# Altium project PCB_Project.PrjPcb
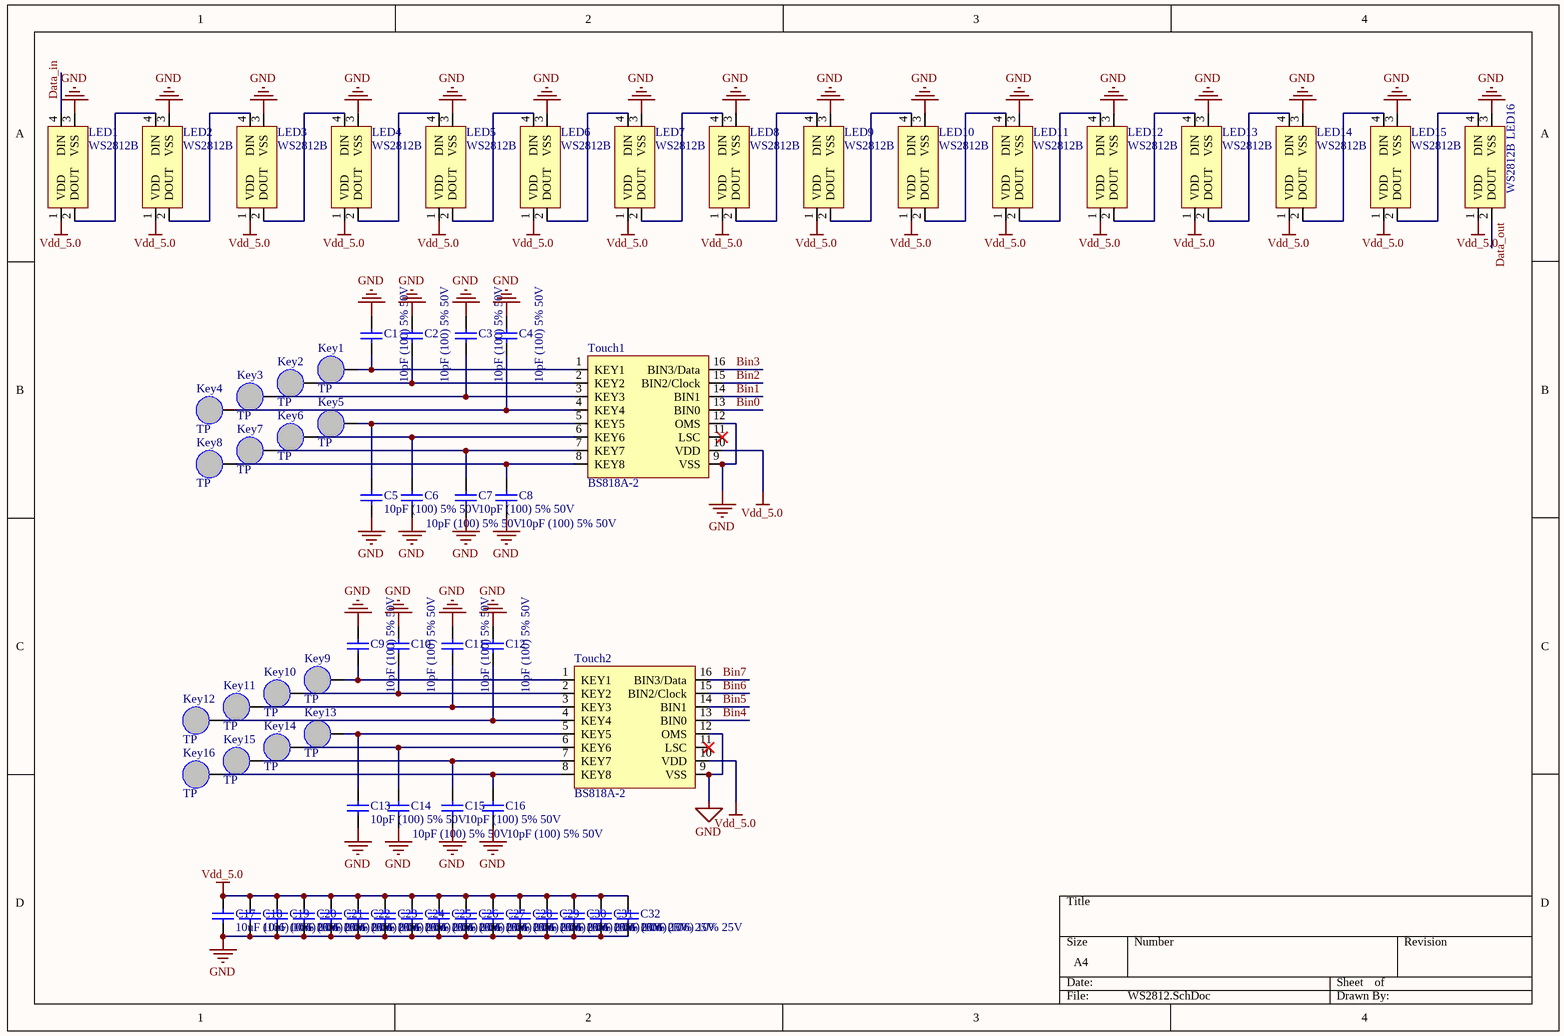
[diagram p0: WS2812.SchDoc]
3 sheets, 105 parts. Net scope: global (net labels, ports and power ports of the same name join across sheets).
Board file: Touch.PcbDoc
Sheets:
  WS2812.SchDoc
  MCU.SchDoc
  POWER.SchDoc

## Sheet WS2812.SchDoc
size A4

### Parts
C1  10pF (100) 5% 50V  [0603_C]
C2  10pF (100) 5% 50V  [0603_C]
C3  10pF (100) 5% 50V  [0603_C]
C4  10pF (100) 5% 50V  [0603_C]
C5  10pF (100) 5% 50V  [0603_C]
C6  10pF (100) 5% 50V  [0603_C]
C7  10pF (100) 5% 50V  [0603_C]
C8  10pF (100) 5% 50V  [0603_C]
C9  10pF (100) 5% 50V  [0603_C]
C10  10pF (100) 5% 50V  [0603_C]
C11  10pF (100) 5% 50V  [0603_C]
C12  10pF (100) 5% 50V  [0603_C]
C13  10pF (100) 5% 50V  [0603_C]
C14  10pF (100) 5% 50V  [0603_C]
C15  10pF (100) 5% 50V  [0603_C]
C16  10pF (100) 5% 50V  [0603_C]
C17  10uF (106) 10% 25V  [0805_C]
C18  10uF (106) 10% 25V  [0805_C]
C19  10uF (106) 10% 25V  [0805_C]
C20  10uF (106) 10% 25V  [0805_C]
C21  10uF (106) 10% 25V  [0805_C]
C22  10uF (106) 10% 25V  [0805_C]
C23  10uF (106) 10% 25V  [0805_C]
C24  10uF (106) 10% 25V  [0805_C]
C25  10uF (106) 10% 25V  [0805_C]
C26  10uF (106) 10% 25V  [0805_C]
C27  10uF (106) 10% 25V  [0805_C]
C28  10uF (106) 10% 25V  [0805_C]
C29  10uF (106) 10% 25V  [0805_C]
C30  10uF (106) 10% 25V  [0805_C]
C31  10uF (106) 10% 25V  [0805_C]
C32  10uF (106) 10% 25V  [0805_C]
Key1  TP  [Spring_touch]
Key2  TP  [Spring_touch]
Key3  TP  [Spring_touch]
Key4  TP  [Spring_touch]
Key5  TP  [Spring_touch]
Key6  TP  [Spring_touch]
Key7  TP  [Spring_touch]
Key8  TP  [Spring_touch]
Key9  TP  [Spring_touch]
Key10  TP  [Spring_touch]
Key11  TP  [Spring_touch]
Key12  TP  [Spring_touch]
Key13  TP  [Spring_touch]
Key14  TP  [Spring_touch]
Key15  TP  [Spring_touch]
Key16  TP  [Spring_touch]
LED1  WS2812B  [WS2812]
LED2  WS2812B  [WS2812]
LED3  WS2812B  [WS2812]
LED4  WS2812B  [WS2812]
LED5  WS2812B  [WS2812]
LED6  WS2812B  [WS2812]
LED7  WS2812B  [WS2812]
LED8  WS2812B  [WS2812]
LED9  WS2812B  [WS2812]
LED10  WS2812B  [WS2812]
LED11  WS2812B  [WS2812]
LED12  WS2812B  [WS2812]
LED13  WS2812B  [WS2812]
LED14  WS2812B  [WS2812]
LED15  WS2812B  [WS2812]
LED16  WS2812B  [WS2812]
Touch1  BS818A-2  [SO-16_N]
Touch2  BS818A-2  [SO-16_N]

### Nets
GND: C1.2 C2.2 C3.2 C4.2 C5.2 C6.2 C7.2 C8.2 C9.2 C10.2 C11.2 C12.2 C13.2 C14.2 C15.2 C16.2 C17.1 C18.1 C19.1 C20.1 C21.1 C22.1 C23.1 C24.1 C25.1 C26.1 C27.1 C28.1 C29.1 C30.1 C31.1 C32.1 LED1.3(VSS) LED2.3(VSS) LED3.3(VSS) LED4.3(VSS) LED5.3(VSS) LED6.3(VSS) LED7.3(VSS) LED8.3(VSS) LED9.3(VSS) LED10.3(VSS) LED11.3(VSS) LED12.3(VSS) LED13.3(VSS) LED14.3(VSS) LED15.3(VSS) LED16.3(VSS) Touch1.9(VSS) Touch1.12(OMS) Touch2.9(VSS) Touch2.12(OMS)  [project net POWER_GND]
Vdd_5.0: C17.2 C18.2 C19.2 C20.2 C21.2 C22.2 C23.2 C24.2 C25.2 C26.2 C27.2 C28.2 C29.2 C30.2 C31.2 C32.2 LED1.1(VDD) LED2.1(VDD) LED3.1(VDD) LED4.1(VDD) LED5.1(VDD) LED6.1(VDD) LED7.1(VDD) LED8.1(VDD) LED9.1(VDD) LED10.1(VDD) LED11.1(VDD) LED12.1(VDD) LED13.1(VDD) LED14.1(VDD) LED15.1(VDD) LED16.1(VDD) Touch1.10(VDD) Touch2.10(VDD)
Bin0: Touch1.13(BIN0)
Bin1: Touch1.14(BIN1)
Bin2: Touch1.15(BIN2/Clock)
Bin3: Touch1.16(BIN3/Data)
Bin4: Touch2.13(BIN0)
Bin5: Touch2.14(BIN1)
Bin6: Touch2.15(BIN2/Clock)
Bin7: Touch2.16(BIN3/Data)
Data_in: LED1.4(DIN)
Data_out: LED16.2(DOUT)
NetC1_1: C1.1 Key1.1 Touch1.1(KEY1)
NetC2_1: C2.1 Key2.1 Touch1.2(KEY2)
NetC3_1: C3.1 Key3.1 Touch1.3(KEY3)
NetC4_1: C4.1 Key4.1 Touch1.4(KEY4)
NetC5_1: C5.1 Key5.1 Touch1.5(KEY5)
NetC6_1: C6.1 Key6.1 Touch1.6(KEY6)
NetC7_1: C7.1 Key7.1 Touch1.7(KEY7)
NetC8_1: C8.1 Key8.1 Touch1.8(KEY8)
NetC9_1: C9.1 Key9.1 Touch2.1(KEY1)
NetC10_1: C10.1 Key10.1 Touch2.2(KEY2)
NetC11_1: C11.1 Key11.1 Touch2.3(KEY3)
NetC12_1: C12.1 Key12.1 Touch2.4(KEY4)
NetC13_1: C13.1 Key13.1 Touch2.5(KEY5)
NetC14_1: C14.1 Key14.1 Touch2.6(KEY6)
NetC15_1: C15.1 Key15.1 Touch2.7(KEY7)
NetC16_1: C16.1 Key16.1 Touch2.8(KEY8)
NetLED1_2: LED1.2(DOUT) LED2.4(DIN)
NetLED2_2: LED2.2(DOUT) LED3.4(DIN)
NetLED3_2: LED3.2(DOUT) LED4.4(DIN)
NetLED4_2: LED4.2(DOUT) LED5.4(DIN)
NetLED5_2: LED5.2(DOUT) LED6.4(DIN)
NetLED6_2: LED6.2(DOUT) LED7.4(DIN)
NetLED7_2: LED7.2(DOUT) LED8.4(DIN)
NetLED8_2: LED8.2(DOUT) LED9.4(DIN)
NetLED9_2: LED9.2(DOUT) LED10.4(DIN)
NetLED10_2: LED10.2(DOUT) LED11.4(DIN)
NetLED11_2: LED11.2(DOUT) LED12.4(DIN)
NetLED12_2: LED12.2(DOUT) LED13.4(DIN)
NetLED13_2: LED13.2(DOUT) LED14.4(DIN)
NetLED14_2: LED14.2(DOUT) LED15.4(DIN)
NetLED15_2: LED15.2(DOUT) LED16.4(DIN)

Not connected (* = marked no-connect by the designer): Touch1 11(LSC)*; Touch2 11(LSC)*

### Library data of the parts
C1-C16 = 0603 10pF (100) 5% 50V: 贴片电容; ComponentLink1Description: 供应商链接; ComponentLink1URL: http://www.szlcsc.com/product/details_1986.html; Package: 0603; Supplier: LC; SuppliersPartNumber: C1634
C17-C32 = 0805 10uF (106) 10% 25V: 贴片电容; ComponentLink1Description: 供应商链接; ComponentLink1URL: http://www.szlcsc.com/product/details_16532.html; Package: 0805; Supplier: LC; SuppliersPartNumber: C15850

## Sheet MCU.SchDoc
size A4
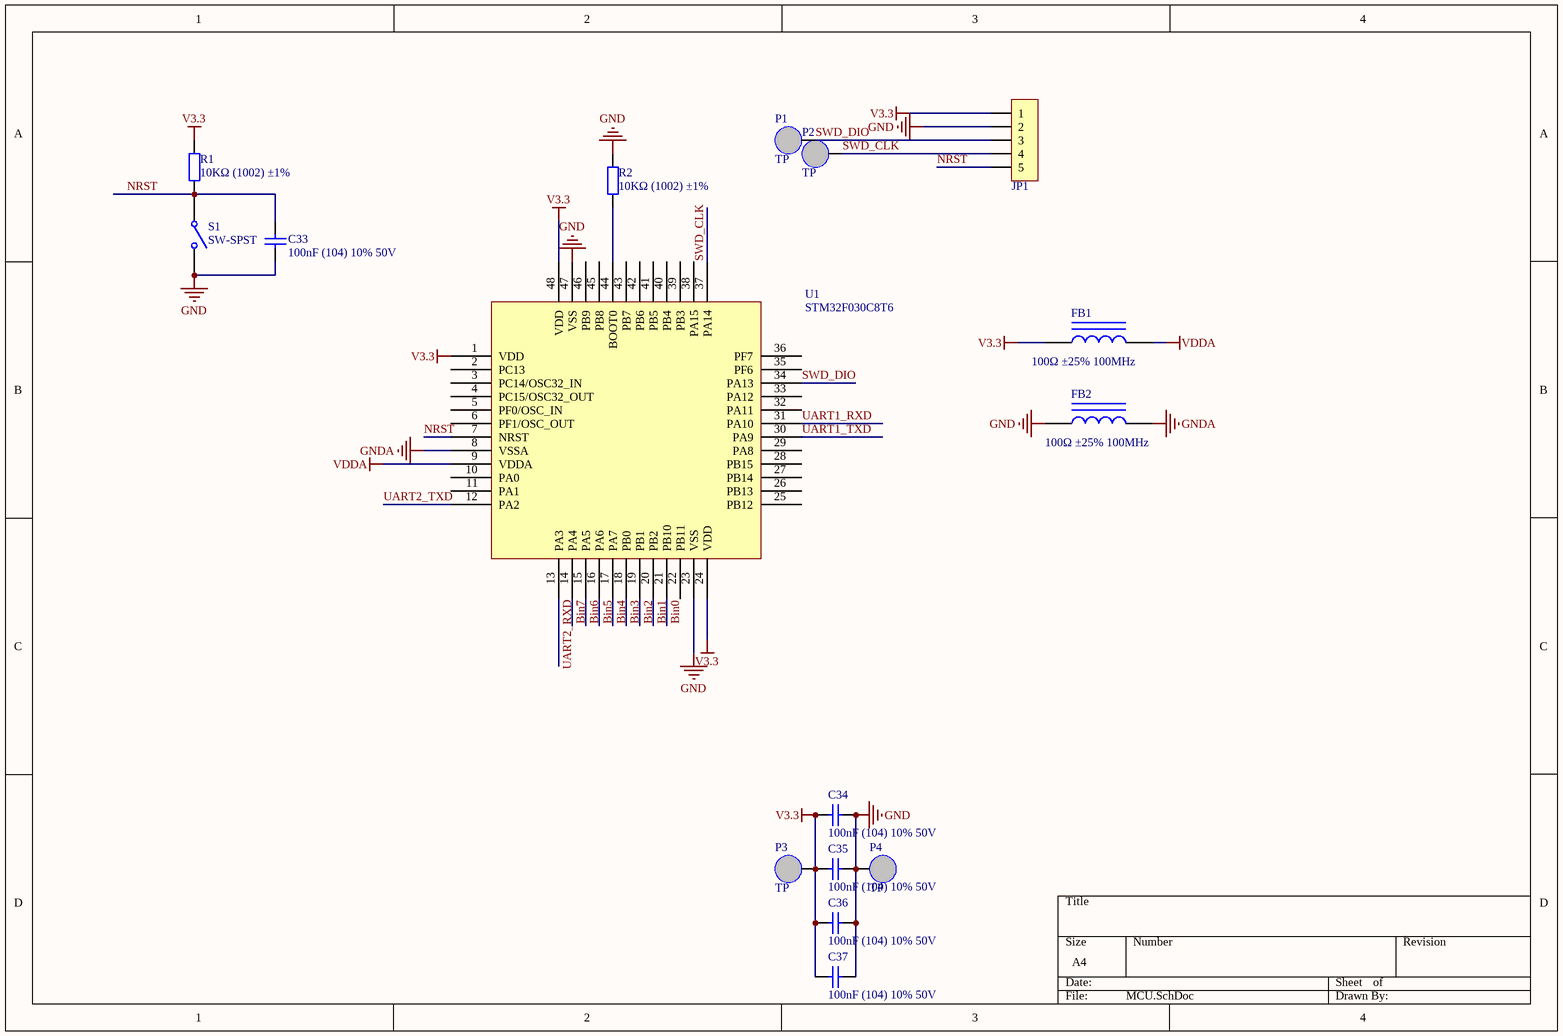
[diagram p1: MCU.SchDoc]

### Parts
C33  100nF (104) 10% 50V  [0603_C]
C34  100nF (104) 10% 50V  [0603_C]
C35  100nF (104) 10% 50V  [0603_C]
C36  100nF (104) 10% 50V  [0603_C]
C37  100nF (104) 10% 50V  [0603_C]
FB1  100Ω ±25% 100MHz  [0805_L]
FB2  100Ω ±25% 100MHz  [0805_L]
JP1  HDR-1X5  [XH2.54-LI-5P]  (value not drawn)
P1  TP  [TP]
P2  TP  [TP]
P3  TP  [TP]
P4  TP  [TP]
R1  10KΩ (1002) ±1%  [0805_R]
R2  10KΩ (1002) ±1%  [0603_R]
S1  SW-SPST  [TSW SMD-3*6*2.5]
U1  STM32F030C8T6  [LQFP-48_7x7x05P]

### Nets
GND: C33.1 C34.2 C35.2 C36.2 C37.2 FB2.1 JP1.2 P4.1 R2.2 S1.2(NO) U1.23(VSS) U1.47(VSS)  [project net POWER_GND]
GNDA: FB2.2 U1.8(VSSA)
V3.3: C34.1 C35.1 C36.1 C37.1 FB1.1 JP1.1 P3.1 R1.2 U1.1(VDD) U1.24(VDD) U1.48(VDD)  [project net POWER_+3.3V]
VDDA: FB1.2 U1.9(VDDA)
Bin0: U1.21(PB10)
Bin1: U1.20(PB2)
Bin2: U1.19(PB1)
Bin3: U1.18(PB0)
Bin4: U1.17(PA7)
Bin5: U1.16(PA6)
Bin6: U1.15(PA5)
Bin7: U1.14(PA4)
NRST: C33.2 JP1.5 R1.1 S1.1(COMMON) U1.7(NRST)
SWD_CLK: JP1.4 P2.1 U1.37(PA14)
SWD_DIO: JP1.3 P1.1 U1.34(PA13)
UART1_RXD: U1.31(PA10)
UART1_TXD: U1.30(PA9)
UART2_RXD: U1.13(PA3)
UART2_TXD: U1.12(PA2)
NetR2_1: R2.1 U1.44(BOOT0)

Not connected (* = marked no-connect by the designer): U1 2(PC13) 3(PC14/OSC32_IN) 4(PC15/OSC32_OUT) 5(PF0/OSC_IN) 6(PF1/OSC_OUT) 10(PA0) 11(PA1) 22(PB11) 25(PB12) 26(PB13) 27(PB14) 28(PB15) 29(PA8) 32(PA11) 33(PA12) 35(PF6) 36(PF7) 38(PA15) 39(PB3) 40(PB4) 41(PB5) 42(PB6) 43(PB7) 45(PB8) 46(PB9)

### Library data of the parts
C33-C37 = 0603 100nF (104) 10% 50V: 贴片电容; ComponentLink1Description: 供应商链接; ComponentLink1URL: http://www.szlcsc.com/product/details_15331.html; Package: 0603; Supplier: LC; SuppliersPartNumber: C14663
FB1 FB2 = 0805 100Ω 25% 100MHz: 贴片磁珠; ComponentLink1Description: 供应商链接; ComponentLink1URL: http://www.szlcsc.com/product/details_1367.html; Package: 0805; Supplier: LC; SuppliersPartNumber: C1015
JP1 = Header 5: 5P接插件; 版权归属: 源创客; BOM名称: 5P接插件; 学习资源: www.ooocke.com
R1 = 0805 10KΩ (1002) 1%: 贴片电阻; ComponentLink1Description: 供应商链接; ComponentLink1URL: http://www.szlcsc.com/product/details_18102.html; Package: 0805; Supplier: LC; SuppliersPartNumber: C17414
R2 = 0603 10KΩ (1002) 1%: 贴片电阻; ComponentLink1Description: 供应商链接; ComponentLink1URL: http://www.szlcsc.com/product/details_26547.html; Package: 0603; Supplier: LC; SuppliersPartNumber: C25804
S1 = SW-SPST: Single-Pole, Single-Throw Switch; Published: 24-Mar-1999; LatestRevisionDate: 17-Jul-2002; LatestRevisionNote: Re-released for DXP Platform.; PackageReference: SPST-2; Publisher: Altium Limited; PackageDescription: Switch; 2 Leads
U1 = STM32F030C8T6: ARM; ComponentLink1Description: 供应商链接; ComponentLink1URL: http://www.szlcsc.com/product/details_24662.html; Package: LQFP-48_7x7x05P; Supplier: LC; SuppliersPartNumber: C23922

## Sheet POWER.SchDoc
size A4
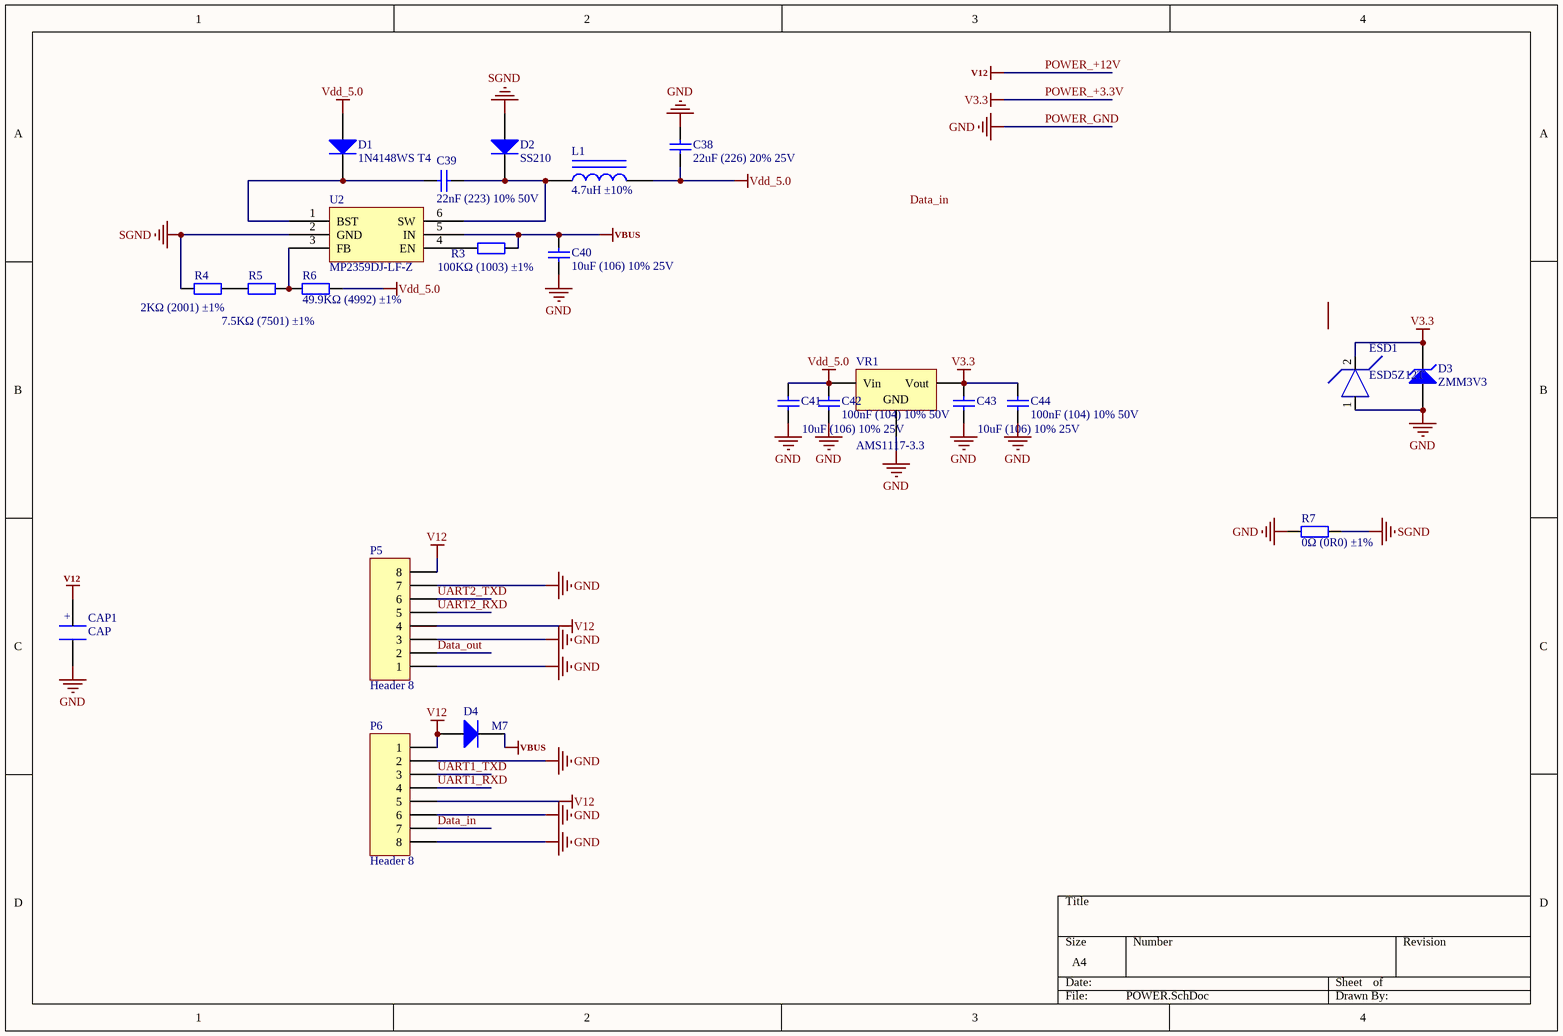
[diagram p2: POWER.SchDoc]

### Parts
C38  22uF (226) 20% 25V  [0805_C]
C39  22nF (223) 10% 50V  [0603_C]
C40  10uF (106) 10% 25V  [0805_C]
C41  10uF (106) 10% 25V  [0805_C]
C42  100nF (104) 10% 50V  [0603_C]
C43  10uF (106) 10% 25V  [0805_C]
C44  100nF (104) 10% 50V  [0603_C]
CAP1  CAP  [8X12_CAP]
D1  1N4148WS T4  [SOD-323]
D2  SS210  [SMA(DO-214AC)_S1]
D3  ZMM3V3  [LL-34]
D4  M7  [SMA(DO-214AC)_S1]
ESD1  ESD5Z12T  [SOD-523]
L1  4.7uH ±10%  [L_4030]
P5  Header 8  [FPC1.0-2H-WS-8P]
P6  Header 8  [FPC1.0-2H-WS-8P]
R3  100KΩ (1003) ±1%  [0603_R]
R4  2KΩ (2001) ±1%  [0603_R]
R5  7.5KΩ (7501) ±1%  [0603_R]
R6  49.9KΩ (4992) ±1%  [0603_R]
R7  0Ω (0R0) ±1%  [0603_R]
U2  MP2359DJ-LF-Z  [SOT-23-6]
VR1  AMS1117-3.3  [SOT-223]

### Nets
POWER_+3.3V: C43.2 C44.2 D3.2(K) ESD1.2 VR1.2(Vout)  [also labelled V3.3]
POWER_+12V: CAP1.1 D4.1(A) P5.4 P5.8 P6.1 P6.5  [also labelled V12]
POWER_GND: C38.2 C40.1 C41.1 C42.1 C43.1 C44.1 CAP1.2 D3.1(A) ESD1.1 P5.1 P5.3 P5.7 P6.2 P6.6 P6.8 R7.1 VR1.1(GND)  [also labelled GND]
SGND: D2.1(A) R4.2 R7.2 U2.2(GND)
VBUS: C40.2 D4.2(K) R3.2 U2.5(IN)
Vdd_5.0: C38.1 C41.2 C42.2 D1.1(A) L1.2 R6.2 VR1.3(Vin)
Data_in: P6.7
Data_out: P5.2
UART1_RXD: P6.4
UART1_TXD: P6.3
UART2_RXD: P5.5
UART2_TXD: P5.6
NetC39_1: C39.1 D1.2(K) U2.1(BST)
NetC39_2: C39.2 D2.2(K) L1.1 U2.6(SW)
NetR3_1: R3.1 U2.4(EN)
NetR4_1: R4.1 R5.2
NetR5_1: R5.1 R6.1 U2.3(FB)

### Notes on the sheet
- Labels drawn without touching a wire or pin: Data_in
- (in symbol CAP) +

### Library data of the parts
C38 = 0805 22uF (226) 20% 25V: 贴片电容; ComponentLink1Description: 供应商链接; ComponentLink1URL: http://www.szlcsc.com/product/details_46786.html; Package: 0805; Supplier: LC; SuppliersPartNumber: C45783
C39 = 0603 22nF (223) 10% 50V: 贴片电容; ComponentLink1Description: 供应商链接; ComponentLink1URL: http://www.szlcsc.com/product/details_21834.html; Package: 0603; Supplier: LC; SuppliersPartNumber: C21122
C40 C41 C43 = 0805 10uF (106) 10% 25V: 贴片电容; ComponentLink1Description: 供应商链接; ComponentLink1URL: http://www.szlcsc.com/product/details_16532.html; Package: 0805; Supplier: LC; SuppliersPartNumber: C15850
C42 C44 = 0603 100nF (104) 10% 50V: 贴片电容; ComponentLink1Description: 供应商链接; ComponentLink1URL: http://www.szlcsc.com/product/details_15331.html; Package: 0603; Supplier: LC; SuppliersPartNumber: C14663
D1 = SOD-323 1N4148WS T4: 二极管; ComponentLink1Description: 供应商链接; ComponentLink1URL: http://www.szlcsc.com/product/details_2485.html; Package: SOD-323; Supplier: LC; SuppliersPartNumber: C2128
D2 = SMA(DO-214AC) SS210: 二极管; ComponentLink1Description: 供应商链接; ComponentLink1URL: http://www.szlcsc.com/product/details_15669.html; Package: SMA(DO-214AC); Supplier: LC; SuppliersPartNumber: C14996
D3 = LL-34 ZMM3V3: 稳压二极管; ComponentLink1Description: 供应商链接; ComponentLink1URL: http://www.szlcsc.com/product/details_8535.html; Package: LL-34; Supplier: LC; SuppliersPartNumber: C8056
D4 = SMA(DO-214AC) M7: 二极管; 备注: 1N4007 4007 编号C2464 已经停售, 使用新物料编号C95872; ComponentLink1Description: 供应商链接; ComponentLink1URL: http://www.szlcsc.com/product/details_2841.html; Package: SMA(DO-214AC); Supplier: LC; SuppliersPartNumber: C95872
ESD1 = ESD-D
L1 = 0603 4.7uH 10%: 贴片电感; ComponentLink1Description: 供应商链接; ComponentLink1URL: http://www.szlcsc.com/product/details_1386.html; Package: 0603; Supplier: LC; SuppliersPartNumber: C1034
P5 P6 = Header 8: Header, 8-Pin; LatestRevisionDate: 17-Jul-2002; LatestRevisionNote: Re-released for DXP Platform.; Publisher: Altium Limited
R3 = 0603 100KΩ (1003) 1%: 贴片电阻; ComponentLink1Description: 供应商链接; ComponentLink1URL: http://www.szlcsc.com/product/details_26546.html; Package: 0603; Supplier: LC; SuppliersPartNumber: C25803
R4 = 0603 2KΩ (2001) 1%: 贴片电阻; ComponentLink1Description: 供应商链接; ComponentLink1URL: http://www.szlcsc.com/product/details_23702.html; Package: 0603; Supplier: LC; SuppliersPartNumber: C22975
R5 = 0603 7.5KΩ (7501) 1%: 贴片电阻; ComponentLink1Description: 供应商链接; ComponentLink1URL: http://www.szlcsc.com/product/details_23961.html; Package: 0603; Supplier: LC; SuppliersPartNumber: C23234
R6 = 0603 49.9KΩ (4992) 1%: 贴片电阻; ComponentLink1Description: 供应商链接; ComponentLink1URL: http://www.szlcsc.com/product/details_23911.html; Package: 0603; Supplier: LC; SuppliersPartNumber: C23184
R7 = 0603 0Ω (0R0) 1%: 贴片电阻; ComponentLink1Description: 供应商链接; ComponentLink1URL: http://www.szlcsc.com/product/details_21903.html; Package: 0603; Supplier: LC; SuppliersPartNumber: C21189
U2 = MP2359DJ-LF-Z_[C14259]: DC-DC芯片; ComponentLink1Description: 供应商链接; ComponentLink1URL: http://www.szlcsc.com/product/details_14917.html; Package: SOT-23-6; Supplier: LC; SuppliersPartNumber: C14259
VR1 = SOT-223 AMS1117-3.3: 低压差线性稳压(LDO); ComponentLink1Description: 供应商链接; ComponentLink1URL: http://www.szlcsc.com/product/details_6652.html; Package: SOT-223; Supplier: LC; SuppliersPartNumber: C6186

## Nets that join several sheets
POWER_+3.3V: MCU (11 pins), POWER (5 pins)
POWER_GND: WS2812 (52 pins), MCU (12 pins), POWER (17 pins)
Vdd_5.0: WS2812 (34 pins), POWER (7 pins)
Bin0: WS2812 (Touch1.13), MCU (U1.21)
Bin1: WS2812 (Touch1.14), MCU (U1.20)
Bin2: WS2812 (Touch1.15), MCU (U1.19)
Bin3: WS2812 (Touch1.16), MCU (U1.18)
Bin4: WS2812 (Touch2.13), MCU (U1.17)
Bin5: WS2812 (Touch2.14), MCU (U1.16)
Bin6: WS2812 (Touch2.15), MCU (U1.15)
Bin7: WS2812 (Touch2.16), MCU (U1.14)
Data_in: WS2812 (LED1.4), POWER (P6.7)
Data_out: WS2812 (LED16.2), POWER (P5.2)
UART1_RXD: MCU (U1.31), POWER (P6.4)
UART1_TXD: MCU (U1.30), POWER (P6.3)
UART2_RXD: MCU (U1.13), POWER (P5.5)
UART2_TXD: MCU (U1.12), POWER (P5.6)